# EAGLE design DebugCAN_v3 (EAGLE 9.6.2)

## Sheet 1 of 2
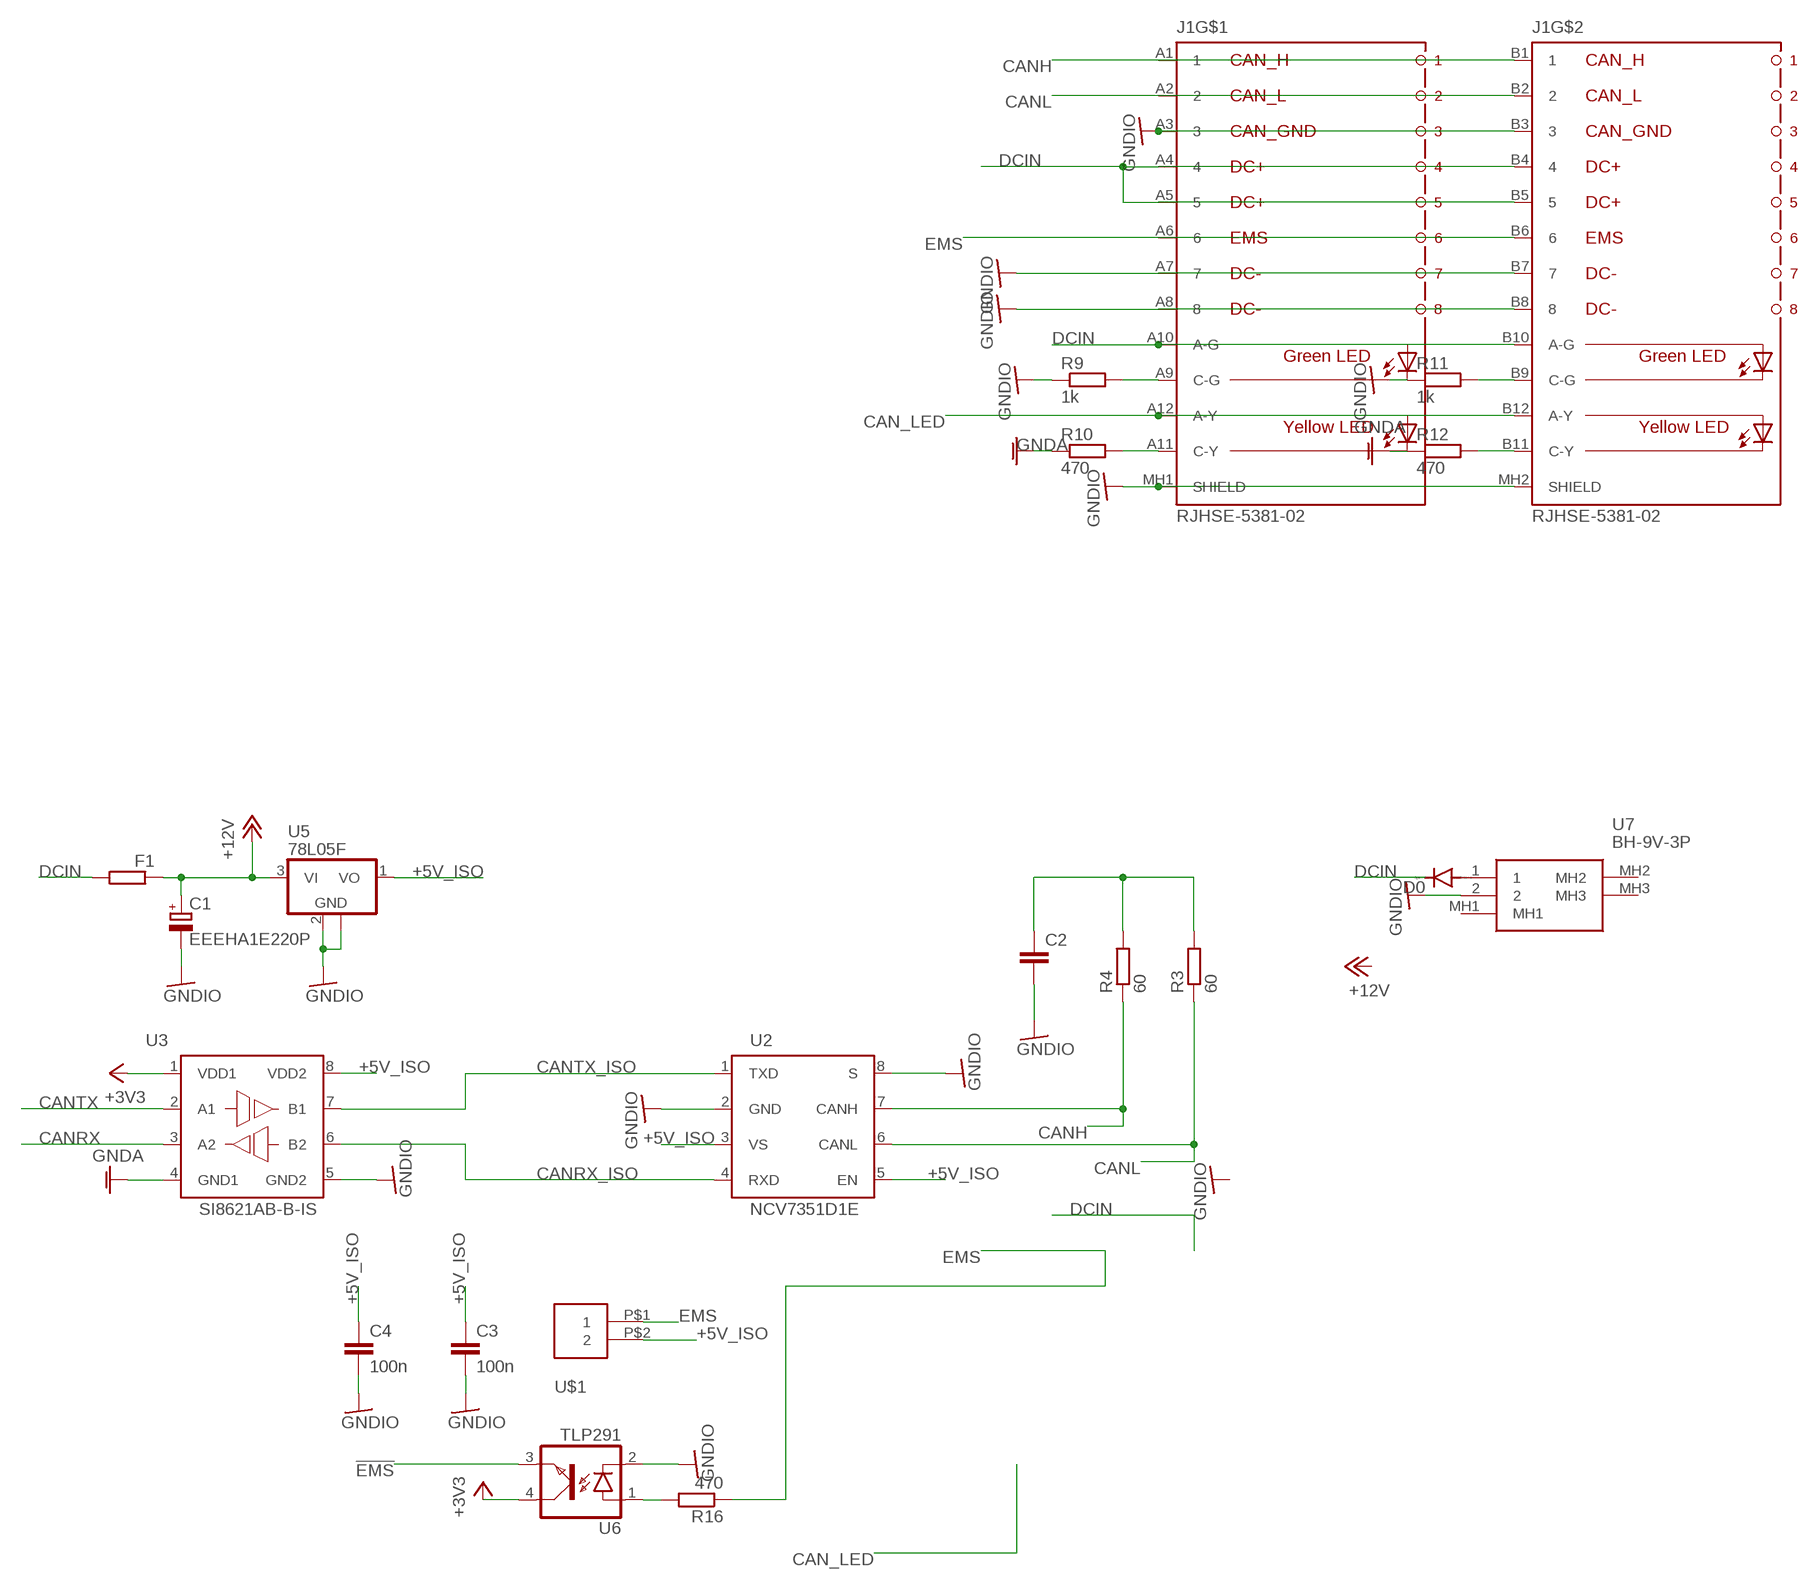
[diagram p0: schematic, sheet 1]

### Parts
C1  EEEHA1E220P  CPOL-EU153CLV-0605  [153CLV-0605]
C2  C-EUC0603  [C0603]
C3  100n  C-EUC0603  [C0603]
C4  100n  C-EUC0603  [C0603]
D0  DIODE-SOD123  [SOD123]
F1  R-EU_R1206  [R1206]
J1  RJHSE-5381-02  [RJHSE538102]
R3  60  R-EU_R0603  [R0603]
R4  60  R-EU_R0603  [R0603]
R9  1k  R-EU_R0603  [R0603]
R10  470  R-EU_R0603  [R0603]
R11  1k  R-EU_R0603  [R0603]
R12  470  R-EU_R0603  [R0603]
R16  470  R-EU_R0603  [R0603]
U2  NCV7351D1E  [SO08]
U3  SI8621AB-B-IS  [SO08]
U5  78L05F  [SOT89]
U6  TLP291  [MINI-FLAT-4]
U7  BH-9V-3P  [BH9V3P]
U$1  XH-2-STRAIGHT  [CON-XH-2-STRAIGHT]

### Nets
!EMS: U6.3(EMIT) ; also sheet 2
+3V3: U3.1(VDD1) U6.4(COL) ; also sheet 2
+5V_ISO [wide]: C3.1 C4.1 U2.3(VS) U2.5(EN) U3.8(VDD2) U5.1(VO) U$1.P$2
+12V [6A]: C1.+ F1.1 U5.3(VI)
CAN_LED: J1.A12(A-Y) J1.B12(A-Y) ; also sheet 2
CANH: J1.A1 J1.B1 R4.1 U2.7(CANH)
CANL: J1.A2 J1.B2 R3.1 U2.6(CANL)
CANRX: U3.3(A2) ; also sheet 2
CANRX_ISO: U2.4(RXD) U3.6(B2)
CANTX: U3.2(A1) ; also sheet 2
CANTX_ISO: U2.1(TXD) U3.7(B1)
DCIN [6A]: D0.C F1.2 J1.A4 J1.A5 J1.A10(A-G) J1.B4 J1.B5 J1.B10(A-G)
EMS: J1.A6 J1.B6 R16.1 U$1.P$1
GNDA: R10.1 R12.1 U3.4(GND1) ; also sheet 2
GNDIO: C1.- C2.2 C3.2 C4.2 J1.A3 J1.A7 J1.A8 J1.B3 J1.B7 J1.B8 J1.MH1(SHIELD) J1.MH2(SHIELD) R9.1 R11.1 U2.2(GND) U2.8(S) U3.5(GND2) U5.2(GND) U5.2@1(GND) U6.2(C) U7.2
N$1: J1.A9(C-G) R9.2
N$4: D0.A U7.1
N$6: C2.1 R3.2 R4.2
N$9: J1.A11(C-Y) R10.2
N$10: J1.B11(C-Y) R12.2
N$12: J1.B9(C-G) R11.2
N$25: R16.2 U6.1(A)
Unconnected: U7.MH1 U7.MH2 U7.MH3

## Sheet 2 of 2
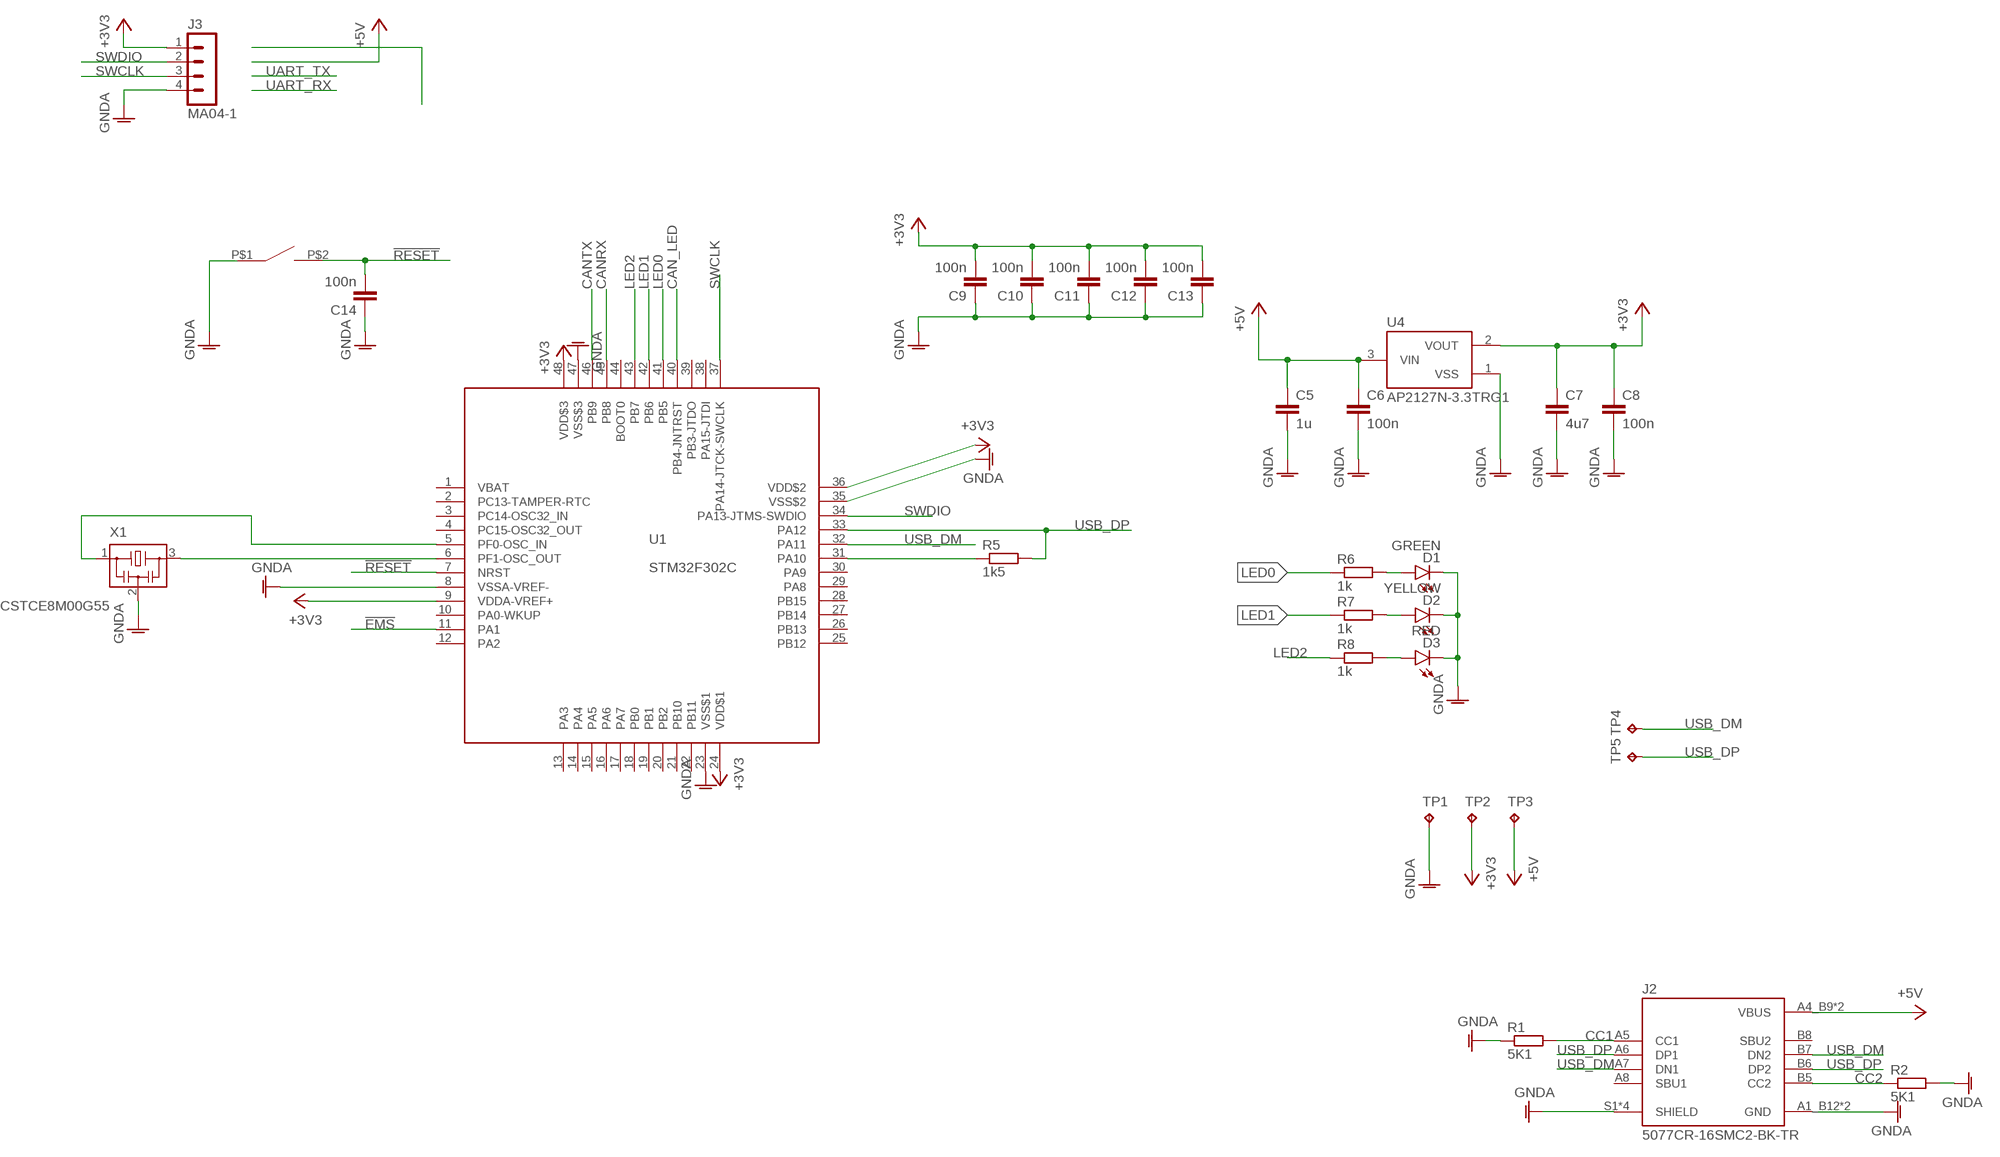
[diagram p1: schematic, sheet 2]

### Parts
C5  1u  C-EUC0603  [C0603]
C6  100n  C-EUC0603  [C0603]
C7  4u7  C-EUC0805  [C0805]
C8  100n  C-EUC0603  [C0603]
C9  100n  C-EUC0603  [C0603]
C10  100n  C-EUC0603  [C0603]
C11  100n  C-EUC0603  [C0603]
C12  100n  C-EUC0603  [C0603]
C13  100n  C-EUC0603  [C0603]
C14  100n  C-EUC0603  [C0603]
D1  GREEN  LEDCHIPLED_0805  [CHIPLED_0805]
D2  YELLOW  LEDCHIPLED_0805  [CHIPLED_0805]
D3  RED  LEDCHIPLED_0805  [CHIPLED_0805]
J2  5077CR-16SMC2-BK-TR  [NELTRON_5077CR-16SMC2-BK-TR]
J3  MA04-1  [MA04-1]
R1  5K1  R-EU_R0603  [R0603]
R2  5K1  R-EU_R0603  [R0603]
R5  1k5  R-EU_R0603  [R0603]
R6  1k  R-EU_R0603  [R0603]
R7  1k  R-EU_R0603  [R0603]
R8  1k  R-EU_R0603  [R0603]
S1  SWITCH_TACTILETOP  [SWITCH_TACTILE_3X6]
TP1  TPB1,27  [B1,27]
TP2  TPB1,27  [B1,27]
TP3  TPB1,27  [B1,27]
TP4  TPB1,27  [B1,27]
TP5  TPB1,27  [B1,27]
U1  STM32F302C  STM32F303C  [LQFP48]
U4  AP2127N-3.3TRG1  XC6206  [SOT95P240X110-3]
X1  CSTCE8M00G55  [CSTCE8M00G55]

### Nets
!EMS: U1.11(PA1) ; also sheet 1
!RESET: C14.2 S1.P$2 U1.7(NRST)
+3V3: C7.1 C8.1 C9.2 C10.2 C11.2 C12.2 C13.2 J3.1 TP2.TP U1.9(VDDA-VREF+) U1.24(VDD$1) U1.36(VDD$2) U1.48(VDD$3) U4.2(VOUT) ; also sheet 1
+5V [wide]: C5.1 C6.1 J2.A4_B9(VBUS) J2.B4_A9(VBUS) TP3.TP U4.3(VIN)
CAN_LED: U1.40(PB4-JNTRST) ; also sheet 1
CANRX: U1.45(PB8) ; also sheet 1
CANTX: U1.46(PB9) ; also sheet 1
CC1: J2.A5(CC1) R1.2
CC2: J2.B5(CC2) R2.1
GNDA: C5.2 C6.2 C7.2 C8.2 C9.1 C10.1 C11.1 C12.1 C13.1 C14.1 D1.C D2.C D3.C J2.A1_B12(GND) J2.B1_A12(GND) J2.S1(SHIELD) J2.S2(SHIELD) J2.S3(SHIELD) J2.S4(SHIELD) J3.4 R1.1 R2.2 S1.P$1 TP1.TP U1.8(VSSA-VREF-) U1.23(VSS$1) U1.35(VSS$2) U1.47(VSS$3) U4.1(VSS) X1.2 ; also sheet 1
LED0: R6.1 U1.41(PB5)
LED1: R7.1 U1.42(PB6)
LED2: R8.1 U1.43(PB7)
N$2: D2.A R7.2
N$5: D1.A R6.2
N$7: U1.6(PF1-OSC_OUT) X1.3
N$8: U1.5(PF0-OSC_IN) X1.1
N$11: R5.1 U1.31(PA10)
N$21: D3.A R8.2
SWCLK: J3.3 U1.37(PA14-JTCK-SWCLK)
SWDIO: J3.2 U1.34(PA13-JTMS-SWDIO)
USB_DM: J2.A7(DN1) J2.B7(DN2) TP4.TP U1.32(PA11)
USB_DP: J2.A6(DP1) J2.B6(DP2) R5.2 TP5.TP U1.33(PA12)
Unconnected: J2.A8(SBU1) J2.B8(SBU2) U1.1(VBAT) U1.2(PC13-TAMPER-RTC) U1.3(PC14-OSC32_IN) U1.4(PC15-OSC32_OUT) U1.10(PA0-WKUP) U1.12(PA2) U1.13(PA3) U1.14(PA4) U1.15(PA5) U1.16(PA6) U1.17(PA7) U1.18(PB0) U1.19(PB1) U1.20(PB2) U1.21(PB10) U1.22(PB11) U1.25(PB12) U1.26(PB13) U1.27(PB14) U1.28(PB15) U1.29(PA8) U1.30(PA9) U1.38(PA15-JTDI) U1.39(PB3-JTDO) U1.44(BOOT0)

## Library data of the parts
C1 = rcl:CPOL-EU: POLARIZED CAPACITOR, European symbol; SPICEPREFIX: C
C2-C4 = rcl:C-EU: CAPACITOR, European symbol; SPICEPREFIX: C
C5-C14 = rcl:C-EU: CAPACITOR, European symbol
D0 = diode:DIODE-: DIODE
D1-D3 = led:LED: LED OSRAM: - CHIPLED LG R971, LG N971, LY N971, LG Q971, LY Q971, LO R971, LY R971 LH N974, LH R974 LS Q976, LO Q976, LY Q976 LO Q996 - Hyper CHIPLED LW Q18S LB Q993, LB Q99A, LB R99A - SideLED LS A670, LO A670, LY A670, LG A670, LP A670 LB A673, LV A673, LT A673, LW A673 LH A674 LY A675 LS A676, LA A676, LO A676, LY A676, LW A676 LS A679, LY A679, LG A679 - Hyper Micro SIDELED® LS Y876, LA Y876, LO Y876, LY Y876 LT Y87S - SmartLED LW L88C, LW L88S LB L89C, LB L89S, LG L890 LS L89K, LO L89K, LY L89K LS L896, LA L896, LO L896, LY L896 - TOPLED LS T670, LO T670, LY T670, LG T670, LP T670 LSG T670, LSP T670, LSY T670, LOP T670, LYG T670 LG T671, LOG T671, LSG T671 LB T673, LV T673, LT T673, LW T673 LH T674 LS T676, LA T676, LO T676, LY T676, LB T676, LH T676, LSB T676, LW T676 LB T67C, LV T67C, LT T67C, LS T67K, LO T67K, LY T67K, LW E67C LS E67B, LA E67B, LO E67B, LY E67B, LB E67C, LV E67C, LT E67C LW T67C LS T679, LY T679, LG T679 LS T770, LO T770, LY T770, LG T770, LP T770 LB T773, LV T773, LT T773, LW T773 LH T774 LS E675, LA E675, LY E675, LS T675 LS T776, LA T776, LO T776, LY T776, LB T776 LHGB T686 LT T68C, LB T68C - Hyper Mini TOPLED® LB M676 - Mini TOPLED Santana® LG M470 LS M47K, LO M47K, LY M47K Source: http://www.osram.convergy.de LUXEON: - LUMILED® LXK2-PW12-R00, LXK2-PW12-S00, LXK2-PW14-U00, LXK2-PW14-V00 LXK2-PM12-R00, LXK2-PM12-S00, LXK2-PM14-U00 LXK2-PE12-Q00, LXK2-PE12-R00, LXK2-PE12-S00, LXK2-PE14-T00, LXK2-PE14-U00 LXK2-PB12-K00, LXK2-PB12-L00, LXK2-PB12-M00, LXK2-PB14-N00, LXK2-PB14-P00, LXK2-PB14-Q00 LXK2-PR12-L00, LXK2-PR12-M00, LXK2-PR14-Q00, LXK2-PR14-R00 LXK2-PD12-Q00, LXK2-PD12-R00, LXK2-PD12-S00 LXK2-PH12-R00, LXK2-PH12-S00 LXK2-PL12-P00, LXK2-PL12-Q00, LXK2-PL12-R00 Source: www.luxeon.com KINGBRIGHT: KA-3528ASYC Source: www.kingbright.com
F1 R3 R4 R9-R12 R16 = rcl:R-EU_: RESISTOR, European symbol; SPICEPREFIX: R
J1 = con-rj45:RJHSE-5381-02: Modular Connectors / Ethernet Connectors R/A RJ45 SHEILDED 2 PORT Y/G LEDS Source: Datasheet <https://componentsearchengine.com/Datasheets/1/RJHSE-5381-02.pdf>; DESCRIPTION: Modular Connectors / Ethernet Connectors R/A RJ45 SHEILDED 2 PORT Y/G LEDS; HEIGHT: 13.46mm; MANUFACTURER_NAME: Amphenol; MANUFACTURER_PART_NUMBER: RJHSE-5381-02; MOUSER_PART_NUMBER: 523-RJHSE-5381-02; MOUSER_PRICE-STOCK: https://www.mouser.com/Search/Refine.aspx?Keyword=523-RJHSE-5381-02
J2 = 5077CR-16SMC2-BK-TR:5077CR-16SMC2-BK-TR: Check availability <https://pricing.snapeda.com/parts/5077CR-16SMC2-BK-TR/Neltron/view-part?ref=eda>; AVAILABILITY: Not in stock; CHECK_PRICES: https://www.snapeda.com/parts/5077CR-16SMC2-BK-TR/Neltron/view-part/?ref=eda; DESCRIPTION: USB 3.1 C Type Female with Peg; MF: Neltron; MP: 5077CR-16SMC2-BK-TR; PACKAGE: Package; PRICE: None; SNAPEDA_LINK: https://www.snapeda.com/parts/5077CR-16SMC2-BK-TR/Neltron/view-part/?ref=snap
J3 = con-headers:MA04-1
R1 R2 R5-R8 = rcl:R-EU_: RESISTOR, European symbol
S1 = switch-tactile:SWITCH_TACTILE
TP1-TP5 = testpad:TP: Test pad
U1 = stm32_mcu:STM32F303C*
U2 = on-semi:NCV7351D1E: High Speed CAN Transceiver Source: NCV7351-D.PDF <http://www.onsemi.com/PowerSolutions/document/NCV7351-D.PDF>
U3 = silabs:SI8621AB-B-IS: 1 Mbps Digital Isolator 1 Mbps, 2.5 kVRMS Digital Isolator Source: Si86xx.pdf <https://www.silabs.com/documents/public/data-sheets/Si86xx.pdf>
U4 = torex:XC6206
U5 = linear:78L*: POSITOIV-VOLTAGE REGULATORS Output up to 100 mA Source: Datasheet <http://focus.ti.com/lit/ds/symlink/ua78l05.pdf>
U6 = toshiba:TLP291: TOSHIBA PHOTOCOUPLER GaAs IRED & PHOTO-TRANSISTOR; OC_FARNELL: unknown; OC_NEWARK: unknown
U7 = BH-9V-3P:BH-9V-3P: Takachi Electric Industrial 9V PP3 Battery Holder, Plug in Contact Source: Datasheet; DESCRIPTION: Takachi Electric Industrial 9V PP3 Battery Holder, Plug in Contact; HEIGHT: 20.7mm; MANUFACTURER_NAME: Takachi Electric Industrial; MANUFACTURER_PART_NUMBER: BH-9V-3P
U$1 = con-xh:XH-2-STRAIGHT
X1 = resonator:CSTCE8M00G55

## Net classes
0 default: width 0.25 mm
1 wide: width 0.5 mm
2 6A: width 1.5 mm

## Board
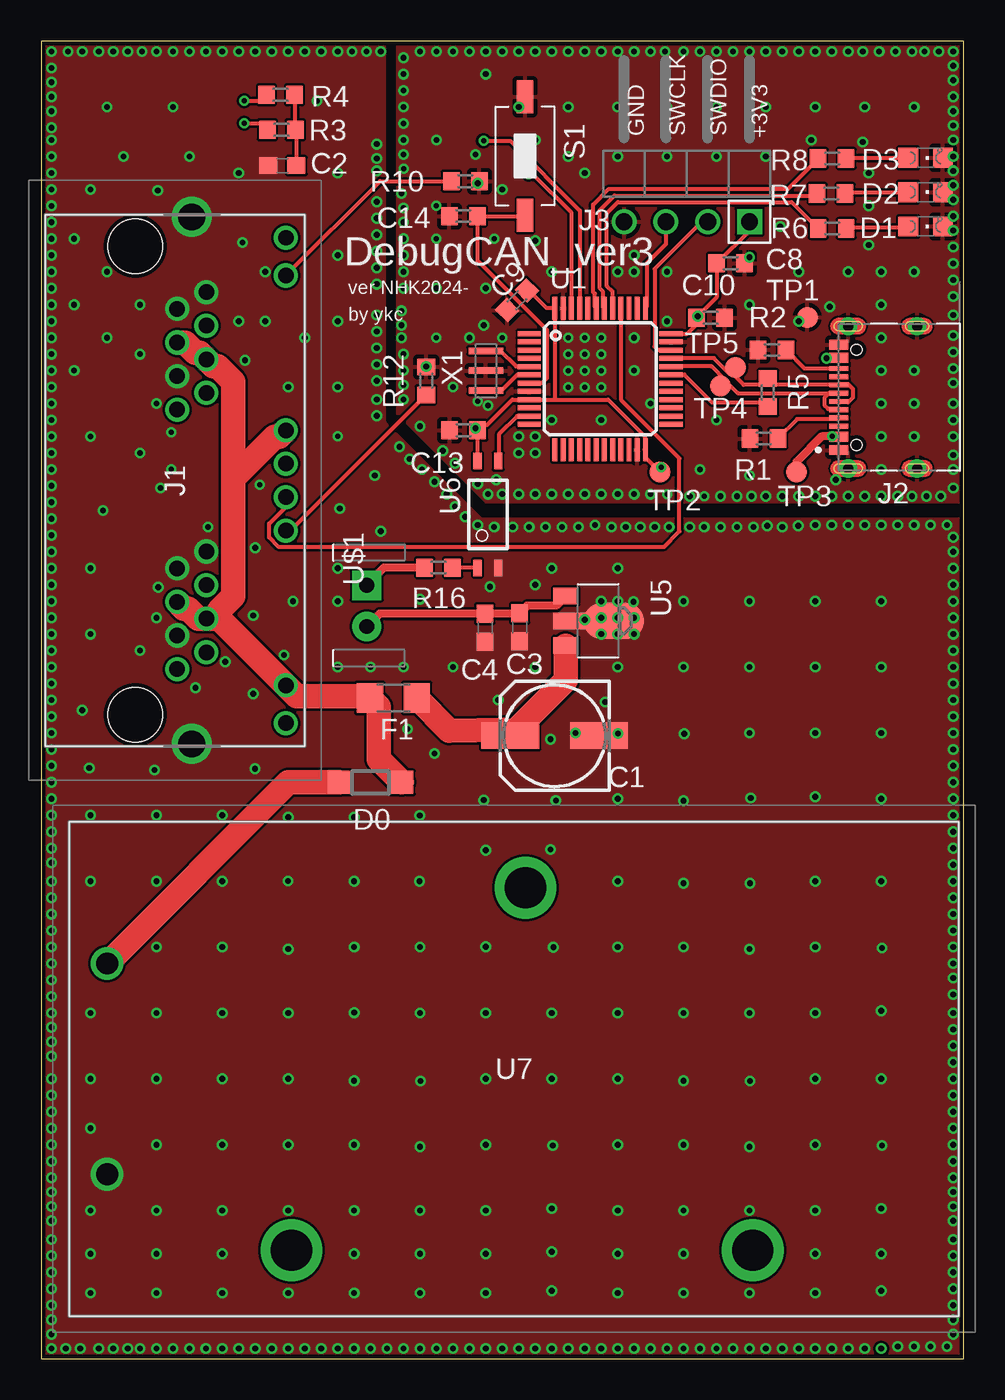
[diagram p2: board, top side]
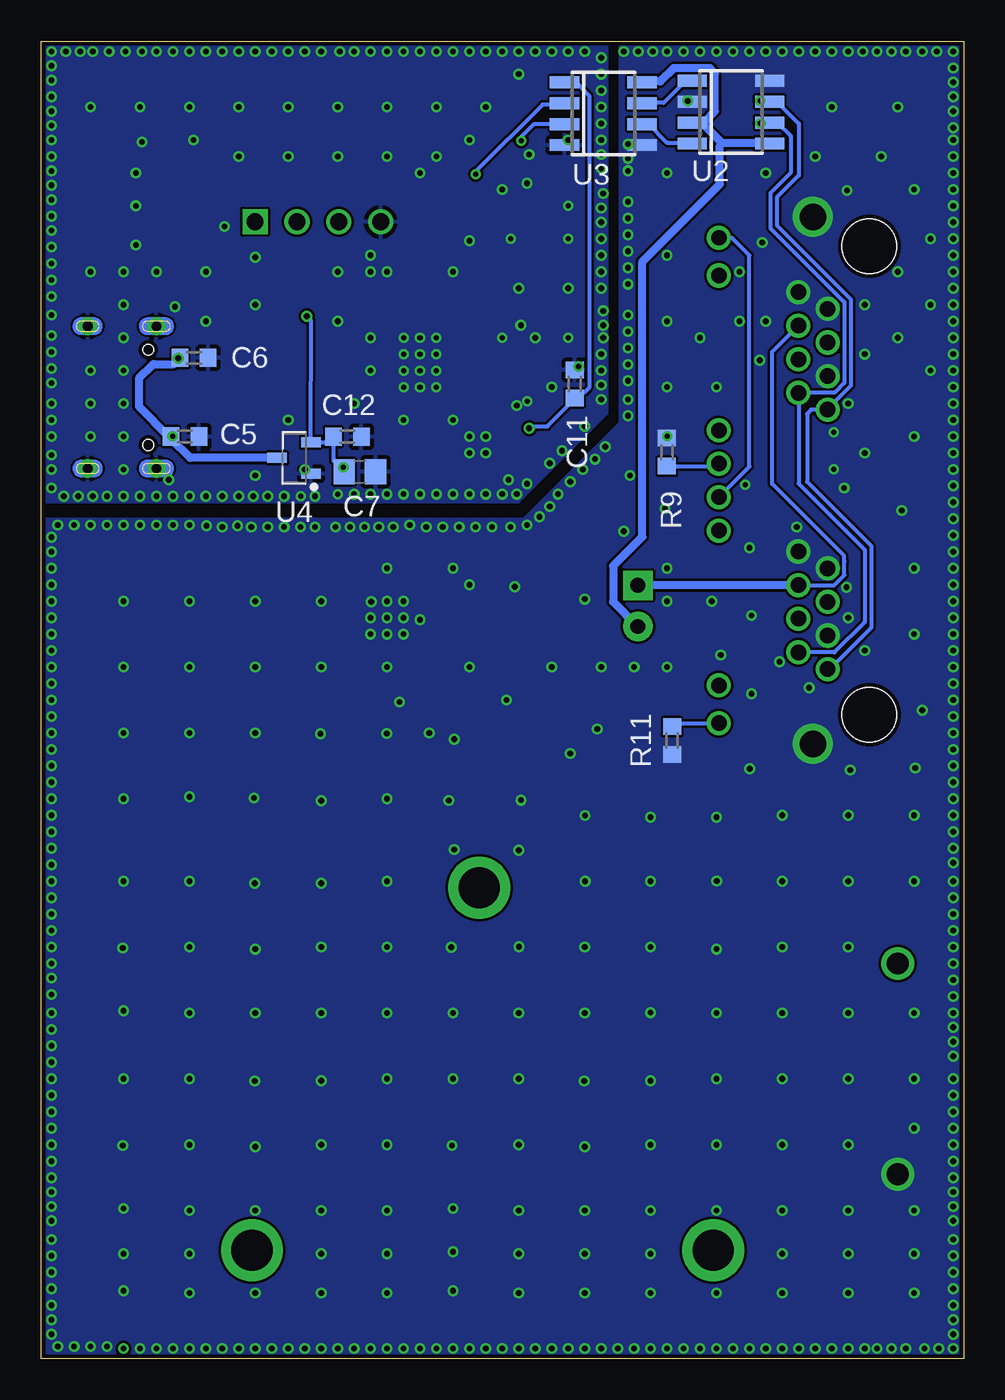
[diagram p3: board, bottom side, seen from below]

Size 56 x 80 mm. Coordinates in mm from the lower left corner, seen from the top.
Outline: 0,0 56,0 56,80 0,80 0,0
Copper layers (1*16): Top 0.035mm / dielectric 1.5mm / Bottom 0.035mm
Design rules "SeeedStudio_2layer_DRU_no_angle_20140221": minimum track width 6mil, minimum drill 12mil, track to track 6mil, track to pad 6mil, pad to pad 6mil, via to via 6mil, smd to smd 0mil, copper to edge 10mil, drill to drill 10mil, minimum pad ring 10mil, minimum via ring 6mil, stop-mask expansion 2mil, vias tented up to drill 100mil, thermal gap 10mil

### Footprints (pad centres in the part's own frame; a part is rotated, then mirrored left to right if it is on the bottom)
153CLV-0605 = smd 3.5 x 1.6: + 2.7,0; - -2.7,0
C0603 = smd 1.1 x 1: 1 -0.85,0; 2 0.85,0
C0603' = smd 1 x 1.1: 1 -0.85,0; 2 0.85,0
C0805 = smd 1.3 x 1.5: 1 -0.95,0; 2 0.95,0
SOD123 = smd 1.4 x 1.4: A 1.9,0; C -1.9,0
CHIPLED_0805 = smd 1.2 x 1.2: A 0,-1.05; C 0,1.05
R1206 = smd 1.6 x 1.803: 1 -1.422,0; 2 1.422,0
RJHSE538102 = drill 0.94 pad 1.462: A1 0,0; A2 -1.02,1.78; A3 -2.04,0; A4 -3.06,1.78; A5 -4.08,0; A6 -5.1,1.78; A7 -6.12,0; A8 -7.14,1.78; A9 3.28,6.6; A10 1.25,6.6; A11 -8.15,6.6; A12 -10.44,6.6; B1 15.75,0; B2 14.73,1.78; B3 13.71,0; B4 12.69,1.78; B5 11.67,0; B6 10.65,1.78; B7 9.63,0; B8 8.61,1.78; B9 19.03,6.6; B10 16.74,6.6; B11 7.34,6.6; B12 5.31,6.6 | drill 1.62 pad 2.43: MH1 -11.705,0.89; MH2 20.295,0.89 | hole 3.3: -9.93,-2.54; 18.52,-2.54
NELTRON_5077CR-16SMC2-BK-TR = smd 0.6 x 1.15: A1_B12 -3.2,1.065; A4_B9 -2.4,1.065; B1_A12 3.2,1.065; B4_A9 2.4,1.065 | smd 0.3 x 1.15: A5 -1.25,1.065; A6 -0.25,1.065; A7 0.25,1.065; A8 1.25,1.065; B5 1.75,1.065; B6 0.75,1.065; B7 -0.75,1.065; B8 -1.75,1.065 | drill 0.6 pad 1: S1 -4.32,-3.68; S2 4.32,-3.68; S3 -4.32,0.5; S4 4.32,0.5 | hole 0.65: -2.89,0; 2.89,0
MA04-1 = drill 1.016 square: 1 3.81,0 | drill 1.016: 2 1.27,0; 3 -1.27,0; 4 -3.81,0
R0603 = smd 1 x 1.1: 1 -0.85,0; 2 0.85,0
SWITCH_TACTILE_3X6 = smd 2 x 1: P$1 -3.6,0; P$2 3.6,0
B1,27 = smd 1.27 x 1.27: TP 0,0
LQFP48 = smd 1.4 x 0.3: 1 -4.3,2.75; 2 -4.3,2.25; 3 -4.3,1.75; 4 -4.3,1.25; 5 -4.3,0.75; 6 -4.3,0.25; 7 -4.3,-0.25; 8 -4.3,-0.75; 9 -4.3,-1.25; 10 -4.3,-1.75; 11 -4.3,-2.25; 12 -4.3,-2.75; 25 4.3,-2.75; 26 4.3,-2.25; 27 4.3,-1.75; 28 4.3,-1.25; 29 4.3,-0.75; 30 4.3,-0.25; 31 4.3,0.25; 32 4.3,0.75; 33 4.3,1.25; 34 4.3,1.75; 35 4.3,2.25; 36 4.3,2.75 | smd 0.3 x 1.4: 13 -2.75,-4.3; 14 -2.25,-4.3; 15 -1.75,-4.3; 16 -1.25,-4.3; 17 -0.75,-4.3; 18 -0.25,-4.3; 19 0.25,-4.3; 20 0.75,-4.3; 21 1.25,-4.3; 22 1.75,-4.3; 23 2.25,-4.3; 24 2.75,-4.3; 37 2.75,4.3; 38 2.25,4.3; 39 1.75,4.3; 40 1.25,4.3; 41 0.75,4.3; 42 0.25,4.3; 43 -0.25,4.3; 44 -0.75,4.3; 45 -1.25,4.3; 46 -1.75,4.3; 47 -2.25,4.3; 48 -2.75,4.3
SO08 = smd 0.72 x 1.78: 1 -1.905,-2.35; 2 -0.635,-2.35; 3 0.635,-2.35; 4 1.905,-2.35; 5 1.905,2.35; 6 0.635,2.35; 7 -0.635,2.35; 8 -1.905,2.35
SOT95P240X110-3 = smd 1.18 x 0.609: 1 -1.024,0.95; 2 -1.024,-0.95; 3 1.024,0
SOT89 = smd 1 x 1.5: 1 -1.499,-1.981; 3 1.499,-1.981 | smd 1 x 2: 2 0,-1.727 | smd 2.2 x 3.7: 2@1 0,0.94
MINI-FLAT-4 = smd 1 x 0.5: 1 -3.24,0.635; 2 -3.24,-0.635; 3 3.24,-0.635; 4 3.24,0.635
BH9V3P = drill 1.33 pad 1.995: 1 0,0; 2 0,-12.8 | drill 2.5 pad 3.75: MH1 11.2,-17.4; MH2 39.2,-17.4; MH3 25.4,4.6
CON-XH-2-STRAIGHT = drill 0.9 pad 1.778 square: P$1 1.21,-0.73 | drill 0.9 pad 1.778: P$2 -1.29,-0.73
CSTCE8M00G55 = smd 0.4 x 2.1: 1 -1.2,0; 2 0,0; 3 1.2,0

### Placement (x,y rotation side)
C1  31.18,37.84 180 top
C2  14.64,72.44 180 top
C3  29.04,44.42 270 top
C4  26.95,44.39 270 top
C5  1u  [C0603']  47.27,55.99 0 bottom
C6  100n  [C0603']  46.72,60.77 0 bottom
C7  36.65,53.85 0 bottom
C8  100n  [C0603']  41.87,66.52 0 top
C9  100n  [C0603']  28.89,64.27 45 top
C10  100n  [C0603']  40.65,63.21 180 top
C11  100n  [C0603']  23.61,59.19 270 bottom
C12  100n  [C0603']  37.41,55.98 180 bottom
C13  100n  [C0603']  25.66,56.38 0 top
C14  100n  [C0603']  25.63,69.38 0 top
D0  20,35 180 top
D1  53.7,68.75 270 top
D2  53.7,70.83 270 top
D3  53.7,72.92 270 top
F1  21.38,40.12 180 top
J1  8.25,57.62 270 top
J2  49.5,58.38 90 top
J3  39.2,69.03 0 top
R1  43.88,55.88 0 top
R2  44.38,61.25 180 top
R3  14.59,74.62 0 top
R4  14.53,76.75 0 top
R5  44.12,58.66 90 top
R6  48.03,68.63 0 top
R7  47.97,70.75 0 top
R8  48.02,72.88 0 top
R9  18.01,55.05 270 bottom
R10  25.75,71.5 180 top
R11  17.7,37.54 90 bottom
R12  23.38,59.38 270 top
R16  24.13,48.04 0 top
S1  29.38,73.03 270 top
TP1  46.52,63.23 0 top
TP2  37.56,53.85 0 top
TP3  45.86,53.85 0 top
TP4  41.24,59.05 0 top
TP5  42.16,60.18 0 top
U1  33.94,59.49 0 top
U2  14.12,75.69 270 bottom
U3  21.87,75.6 270 bottom
U4  40.65,54.7 180 bottom
U5  33.83,44.8 270 top
U6  27.12,51.27 90 top
U7  4,24 0 top
U$1  19.04,45.75 90 top
X1  27,59.99 270 top

### Tracks (layer width: path | path; a pad name or v marks a point on that pad's centre or on a via)
!EMS
  Top 0.25: U1.11 28.9,57.24 27.79,56.13 27.79,54.54 U6.3
!RESET
  Top 0.25: S1.P$2 29.34,69.54 29,69.38 C14.2 26.48,66.69 30.7,62.47 30.7,59.55 30.4,59.25 29.7,59.25 U1.7
+3V3  (via drill 0.3, 0.35)
  Top 0.25: C9.2 29.55,64.92 30.69,63.79 U1.48 31.2,63.67 31.2,58.24 | 31.2,58.24 U1.9 28.61,58.24 27.07,56.7 26.48,56.7 | 31.2,58.24 34.42,58.24 36.64,56.03 36.64,55.22 U1.24 36.69,54.67 36.74,54.62 36.75,54.67 TP2.TP 37.65,53.93 v37.65,54.14 | 26.48,56.7 U6.4 | 26.48,56.7 26.38,56.7 v26.38,56.49 v26.39,56.49 C13.2 | J3.1 43.01,68.5 C8.1 41.02,64.44 v39.87,63.3 39.78,63.22 | U1.36 39.24,62.24 39.78,62.78 39.59,63.02 39.78,63.22 | C10.2 39.78,63.22
  Bottom 0.25: U3.1 24.14,77.56 23.59,77.56 22.73,76.7 22.73,58.97 23.36,58.34 C11.2 23.61,58.28 25.27,56.62 26.25,56.62 v26.38,56.49 | v37.65,54.14 37.6,54.09 C7.1 38.26,54.52 C12.2 38.33,55.65 U4.2 39.61,63.03 v39.87,63.3
+5V  (via drill 0.3, 0.35)
  Top 0.5: TP3.TP 45.86,54.48 47.39,56 v48.03,56 48.05,55.98 J2.A4_B9 | v47.68,60.75 47.71,60.77 J2.B4_A9
  Bottom 0.5: U4.3 46.95,54.7 48.12,55.87 C5.1 | C5.1 48.12,56 v48.03,56 | C5.1 48.24,55.99 50.06,57.82 50.06,59.52 49.19,60.4 47.94,60.4 C6.1 47.59,60.75 v47.68,60.75
+5V_ISO
  Top 0.5: U5.1 31.27,45.73 29.5,45.73 C3.1 29.01,45.24 C4.1 20.55,45.24 U$1.P$2
  Bottom 0.5: 14.69,73.84 11.77,73.84 U2.5 | 14.69,73.84 15.89,75.05 16.4,75.05 U2.3 15.69,75.15 15.09,75.75 15.09,78.06 15.39,78.37 17.61,78.37 18.41,77.56 19.52,77.56 U3.8 | 14.69,73.84 14.79,73.64 14.79,71.32 19.5,66.61 19.5,49.91 21.27,48.14 21.27,45.96 U$1.P$2
+12V
  Top 1.5: F1.1 24.78,38.14 28.11,38.2 C1.+ 31.84,41.2 U5.3
CAN_LED
  Top 0.25: U1.40 35.23,63.77 35.23,58.19 38.75,54.67 38.75,50.23 37.79,49.28 14.43,49.28 13.84,49.87 13.84,50.7 14.85,51.71 J1.B12
  Bottom 0.25: J1.B12 13,54.16 13,67 14.06,68.06 J1.A12
CANH  (via drill 0.3)
  Top 0.25: v12.33,76.39 13.32,76.39 R4.1
  Bottom 0.25: v12.33,76.39 12.3,76.35 11.77,76.35 U2.7 11.32,76.33 10,75 10,71.85 11.33,70.52 11.33,68.82 6.84,64.33 6.84,59.08 8.25,57.67 J1.A1 9.25,57.62 9.5,57.38 9.5,53.25 5.6,49.35 5.6,44.4 8.12,41.88 J1.B1
CANL  (via drill 0.3)
  Top 0.25: v12.33,75.03 13.68,75.03 13.68,74.64 R3.1
  Bottom 0.25: v12.33,75.03 11.8,75.03 U2.6 11.67,75.05 11.3,75.05 10.5,74.25 10.5,72 11.73,70.77 11.73,68.65 7.24,64.16 7.24,59.25 7.83,58.66 10.02,58.66 J1.A2 10.01,58.62 10.01,53.13 6.01,49.13 6.01,44.73 7.84,42.9 J1.B2
CANRX  (via drill 0.3)
  Top 0.25: v26.86,73.94 28.48,73.94 32.71,69.71 32.71,63.87 U1.45
  Bottom 0.25: v26.86,73.94 26.86,74.19 26.1,74.95 24.25,74.95 U3.3
CANRX_ISO
  Bottom 0.25: U2.4 16.5,73.84 18.01,73.84 19.11,74.95 19.52,74.95 U3.6
CANTX  (via drill 0.3)
  Top 0.25: v29.61,71.93 29.86,71.93 32.21,69.58 32.21,63.87 U1.46
  Bottom 0.25: v29.61,71.93 29.61,72.09 25.55,76.15 24.25,76.15 U3.2
CANTX_ISO
  Bottom 0.25: U3.7 19.52,76.25 18.21,76.25 16.9,77.56 16.5,77.56 U2.1
CC1
  Top 0.25: J2.A5 48.36,57.05 45.9,57.05 R1.2
CC2
  Top 0.25: J2.B5 46.35,60.12 R2.1
DCIN
  Top 1.5: J1.B5 8.66,45.55 8.93,45.55 9.54,44.94 J1.B4 10.8,44.94 | 10.8,44.94 J1.B10 15.51,40.23 19.85,40.23 F1.2 20.48,39.6 20.48,36.42 D0.C | J1.A10 14.45,55.98 14.17,55.98 11.66,53.47 | 10.8,44.94 10.8,45.44 11.66,46.3 11.66,53.47 | J1.A5 8.74,61.7 9.35,61.09 9.62,61.09 J1.A4 10.44,60.28 10.71,60.28 11.66,59.32 11.66,53.47
EMS
  Top 0.5: U$1.P$1 19.77,47.1 19.91,47.15 20.81,48.04 R16.1
  Bottom 0.25: J1.B6 7.84,46.98 7.24,47.58 7.24,48.41 7.25,48.42 7.25,48.75 11.62,53.12 11.62,61.13 J1.A6
  Bottom 0.5: J1.B6 16.71,46.98 U$1.P$1
GNDA  (via drill 0.3, 0.35)
  other vias: 26.5,58.12 28,62 34,59 34,60 34,61 34,62 33,62 33,61 32,62 32,61 33,60 32,59 33,59 24,68 24,70 22,72.25 27.5,68 40.25,52.38 38,52.5 24,62 32,60 24,65 34,57 31,57 30,56 30,55 29,55 33,52.5 32,52.5 29,56 31,52.5 30,52.5 29,52.5 28,52.5 27.12,52.5 27.12,57.88 25.12,54.38 46,63 21.88,62 23.38,60.25 55.38,73 55.38,69.38 50.25,67.62 50.25,72 44.88,68.75 44,73 49.88,73.88 44,76 45,79.38 48,79.38 55.38,79.38 53,56 51,62 51,60 50.25,70 46.75,74 51,56 53,66 51,54 48.25,53.38 45,52.38 43,53.62 53,58 51,58 47.88,63.88 46,66 38,63 43,66.88 43,64 38,66 36,67 35,66 36,66 30,67.88 33,72 32,73 32,76 35,76 35,73 38,73 38,76 41,76 25,59 41,79.38 37.88,79.38 41,73 35,79.38 32,79.38 51,66 40,54 26.88,62.75 27,65 27,78 24,74 29,76 30,74 28,71 29,79.38 26,79.38 23,79.38 39.38,52.38 41,57 31,66 53,60 36,52.5 37,52.5 34,52.5 35,52.5 22,79 22,78 22,77 22,76 22,75 22,74 22,73.12 21.88,70.75 22,69.88 22,69 41.25,52.38 22,68 22,67 22,66 22,65 21.88,63.62 21.88,62.75 24.38,55.12 26,62 22,61 23,56.62 22,60 22,59.12 22,58.25 34,79.38 33,79.38 31,79.38 30,79.38 28,79.38 27,79.38 25,79.38 24,79.38 26.5,53.12 27.62,53.38 42,79.38 43,79.38 44,79.38 49,79.38 47,79.38 46,79.38 40,79.38 39,79.38 37,79.38 36,79.38 55.38,71.25 55.38,72.12 55.38,70.38 55.38,78.5 55.38,77.62 54.5,79.38 53.62,79.38 44,52.38 46,52.38 47,52.38 48,52.38 49,52.38 50,52.38 51,52.38 52,52.38 52.88,52.38 53.75,52.38 54.62,52.38 55.38,52.88 55.38,54 55.38,54.88 55.38,56 55.38,57 55.38,58 55.38,59.25 55.38,60.12 42.25,52.38 43.12,52.38 55.38,68.5 55.38,66.5 55.38,67.5 55.38,65.5 55.38,64.5 55.38,63.38 55.38,62.12 55.38,61.12 26.5,71.38 26.38,73.12 36,62 36,60 37,58 47,76 51.88,79.38 52.88,79.38 50.88,79.38 49.88,79.38 55.38,76.62 55.38,74.88 55.38,75.75 55.38,74 49,66 51,64 50,76 53,76
  pour Bottom: 27,52 56,52 56,80 21.62,80 21.62,57.38
  pour Top: 27,52 56,52 56,80 21.62,80 21.62,57.38
GNDIO  (via drill 0.3, 0.35)
  other vias: 18,56 35,46 34,46 34,44 39.38,50.5 31,48 39,46 35,48 38.12,50.5 43.25,50.5 55.38,23.12 55.38,22.12 39,42 43,38 43,42 43,46 47,46 47,50.62 51,50.62 51,46 55.38,46 55.38,42 51,42 47,42 55.38,38 51,38 47,38 51,34 55.38,34 35,34 51,21.12 23,21 31,21 35,21 39,21 43,21 43,24.88 47,21 55.38,19 55.38,24 55.38,28 51,29 26.5,50.62 27.5,50.5 28.62,50.5 29.62,50.5 30.62,50.5 31.62,50.5 32.62,50.5 33.62,50.62 23.12,54 23.88,53.25 24.62,52.5 25.12,51.75 21.75,55.38 22.38,54.62 20.38,57.25 20.38,58.25 20.38,59.38 20.38,60.38 20.38,61.38 20.38,62.38 20.38,63.38 20.38,65.25 20.38,66.25 20.38,67.25 20.38,69.25 20.38,68.25 20.38,70.25 20.38,73.75 20.38,72.88 20.62,79.38 19.75,79.38 18.88,79.38 18,79.38 17,79.38 16,79.38 15,79.38 14,79.38 13,79.38 12,79.38 11,79.38 10,79.38 9,79.38 8,79.38 7,79.38 6.12,79.38 3.5,79.38 2.5,79.38 1.62,79.38 0.62,79.38 0.62,78.38 0.62,77.5 0.62,76.62 0.62,74 0.62,70 0.62,73 0.62,72 0.62,71 54,50.62 55,50.62 53,50.62 52,50.62 50,50.62 49,50.62 48,50.62 42.25,50.5 41.25,50.5 40.25,50.5 37.25,50.5 36.38,50.5 34.62,50.5 35.5,50.5 0.62,50 0.62,69 0.62,68 0.62,67 0.62,66 0.62,65 0.62,64 0.62,63 0.62,62 0.62,61 0.62,60 0.62,51 0.62,59 0.62,58 0.62,57 0.62,56 0.62,55 0.62,54 0.62,53 0.62,52 0.62,49 0.62,48 0.62,47 0.62,46 0.62,45 0.62,44 0.62,43 0.62,42 0.62,41 0.62,40 0.62,39 0.62,38 0.62,37 0.62,36 0.62,35 0.62,34 0.62,33 0.62,32 0.62,31 0.62,30.12 0.62,29 0.62,28 0.62,27 0.62,26 0.62,25 0.62,24 0.62,23 0.62,21 0.62,20.12 0.62,19.25 0.62,18.38 0.62,22 1.5,0.62 2.38,0.62 3.5,0.62 6,0.62 7,0.62 8,0.62 9,0.62 10,0.62 11,0.62 12,0.62 13,0.62 14,0.62 16,0.62 15,0.62 17,0.62 18,0.62 19,0.62 20,0.62 21,0.62 23,0.62 22,0.62 24,0.62 25,0.62 26,0.62 27,0.62 28,0.62 29,0.62 30,0.62 31,0.62 32,0.62 33,0.62 34,0.62 35,0.62 36,0.62 37,0.62 38,0.62 39,0.62 40,0.62 41,0.62 42,0.62 43,0.62 44,0.62 45,0.62 46,0.62 47,0.62 48,0.62 49,0.62 50,0.62 55.38,18 54,0.75 53,0.75 52,0.75 55.38,21 55.38,20 55.38,25 55.38,27 55.38,26 55.38,37 55.38,36 55.38,35 55.38,33 55.38,32 55.38,31 55.38,30 55.38,29 55.38,43 55.38,41 55.38,40 55.38,39 55.38,44 55.38,49.88 55.38,49 55.38,48 55.38,47 55.38,45 33,44.88 30,47 30,42 27.25,46.88 18,48 18,42 23,46.12 15,24.88 19,25 11,21 3,71 2,68 4,66 2,64 6,64 12,72 20.38,72.12 18,63 16,62 18,59 25.75,51.12 20.62,50.25 3.75,51.5 3,44 6,43 2.5,39.38 3,33 3,29 11,29 7,33 11,25 18,72 18,67 2,60 39,33.88 4,62 7,58 4.38,79.38 15,32.88 47,29 39,28.88 39,25 16.75,76.38 32.44,38 39.04,37.96 35.02,37.97 26.86,33.92 45.96,50.59 34,45 35,45 45,50.5 36,45 36,44 35,44 22,42 18,46 2.93,35.88 25,42 23.88,36.75 44.09,50.59 34.25,39.88 27.75,40 12.23,67.77 12.98,35.83 31.25,33.89 31.1,24.99 43.08,34.05 35.96,45.96 22.24,38.24 22.99,32.99 30.92,37.62 43.03,28.87 14.74,42.74 7.89,56.26 7.89,54 22.98,29 19,21.02 51.05,24.95 26.99,25.02 30.93,30.93 23,25 35,25 27,30.88 14.98,29.01 7.11,46.85 13.26,53.08 13.6,63 13.6,66 12,63 15,59 35,29 15,21 47,25 3,56 6,55 3,48 20,42 19,29 18.12,51.62 20.25,53.62 7.25,52.88 9.38,40.75 27,21 47,34.12 35,42 10.12,50.5 11.17,42.33 7,45 6,61 7.07,70.93 15.29,46 12.88,40.38 6.88,35.75 11,33 12.88,45.12 13,49.25 12.38,60.62 19,32.88 51,9.12 35,9 39,9 43,9 43,12.88 47,9 51,17 47,17 39,16.88 39,13 43.03,16.87 51.05,12.95 35,13 35,17 47,13 31,9.12 15,9 19,9 23,9 23,12.88 27,9 31,17 27,17 19,16.88 19,13 23.03,16.87 31.05,12.95 15,13 15,17 27,13 7,21 3,21 7,25 7,9 7,17 7,13 11,9 11,17 11,13 0.62,17 0.62,16 0.62,15 0.62,14 0.62,13 0.62,11 0.62,10.12 0.62,9.25 0.62,8.38 0.62,12 5.25,0.62 4.38,0.62 0.62,7.25 0.62,6.25 0.62,5.25 0.62,3.25 0.62,2.38 0.62,1.5 0.62,0.62 0.62,4.25 51,4.12 35,4 39,4 43,4 47,4 31,4.12 15,4 19,4 23,4 27,4 7,4 11,4 35,6.38 39,6.38 31,6.5 19,6.38 23,6.38 27,6.38 3,6.38 7,6.38 11,6.38 47,6.38 51,6.38 55,0.75 55.38,17 55.38,16 55.38,15 55.38,14 55.38,13 55.38,11 55.38,10.12 55.38,9.25 55.38,8.38 55.38,12 55.38,7.25 55.38,6.25 55.38,5.25 55.38,3.25 55.38,2.38 55.38,1.5 55.38,4.25 3,9 3,17 3,14 3,4 7,29 0.62,75.75 0.62,74.75 5,73 9,73 8,76 4,76 5.25,79.38
  pour Top (no thermals): 26.77,51 26.74,51.01 20.89,56.86 20.88,56.89 20.88,80 0,80 0,0 56,0 56,51
  pour Bottom (no thermals): 26.77,51 26.74,51.01 20.89,56.86 20.88,56.89 20.88,80 0,80 0,0 56,0 56,51
LED0
  Top 0.25: R6.1 46.81,69 46.79,69 45.57,70.22 35.01,70.22 34.35,69.56 34.35,65.13 34.69,64.79 U1.41
LED1
  Top 0.25: R7.1 47.24,70.63 34.8,70.63 33.91,69.75 33.91,64.99 34.12,64.78 34.12,63.87 U1.42
LED2
  Top 0.25: R8.1 47.21,72.88 45.35,71.03 34.47,71.03 33.51,70.07 33.51,64.78 33.62,64.68 33.62,63.87 U1.43
N$1
  Bottom 0.25: J1.A9 14.99,54.2 R9.2
N$2
  Top 0.25: R7.2 48.84,70.79 52.56,70.79 D2.A
N$3  (via drill 0.35)
  other vias: 51,0.62
N$4
  Top 1.5: U7.1 15,35 D0.A
N$5
  Top 0.25: R6.2 48.94,68.68 52.56,68.68 D1.A
N$6
  Top 0.25: R4.2 15.39,76.66 15.39,74.64 R3.2 15.49,74.54 15.49,72.53 C2.1
N$7
  Top 0.25: U1.6 29.59,59.75 28.91,59.75 27.98,58.82 27.07,58.82 X1.3
N$8
  Top 0.25: U1.5 29.59,60.25 28.83,60.25 27.83,61.26 27.07,61.26 X1.1
N$9
  Top 0.25: J1.A11 20.57,71.5 R10.2
N$10
  Top 0.25: R12.2 15.13,50.28 J1.B11
N$11
  Top 0.25: R5.1 43.88,58.06 40.74,58.06 39.05,59.75 U1.31
N$12
  Bottom 0.25: J1.B9 17.49,38.59 R11.2
N$21
  Top 0.25: R8.2 48.94,72.9 52.56,72.9 D3.A
N$25
  Top 0.25: U6.1 25,48.02 R16.2
SWCLK
  Top 0.25: U1.37 36.76,63.86 36.76,66.51 37.93,67.68 J3.3
SWDIO
  Top 0.25: J3.2 40.09,69.03 37.24,66.18 37.24,61.46 37.44,61.26 38.15,61.26 U1.34
USB_DM
  Top 0.25: U1.32 38.25,60.25 40.71,60.25 41.58,59.39 TP4.TP 41.87,59.05 | J2.B7 48.39,57.67 47.77,57.67 47.58,57.86 47.58,58.39 47.82,58.62 J2.A7
  Top 0.254: 41.87,59.05 42.3,58.62 J2.A7
USB_DP
  Top 0.25: U1.33 38.25,60.76 40.84,60.76 41.78,59.8 TP5.TP 42.16,59.63 42.65,59.14 43.74,59.14 R5.2 44.47,59.17 48.39,59.17 J2.B6 48.49,59.18 49,59.18 49.29,58.89 49.29,58.36 49,58.07 48.49,58.07 J2.A6

### Text on the board
tPlace: GND | SWCLK | SWDIO | +3V3 | DebugCAN_ver3 | ver NHK2024-Ⅳ | by ykc